# Altium schematic sheet brain.SchDoc
size A3; SheetNumber: 5; SheetTotal: 8
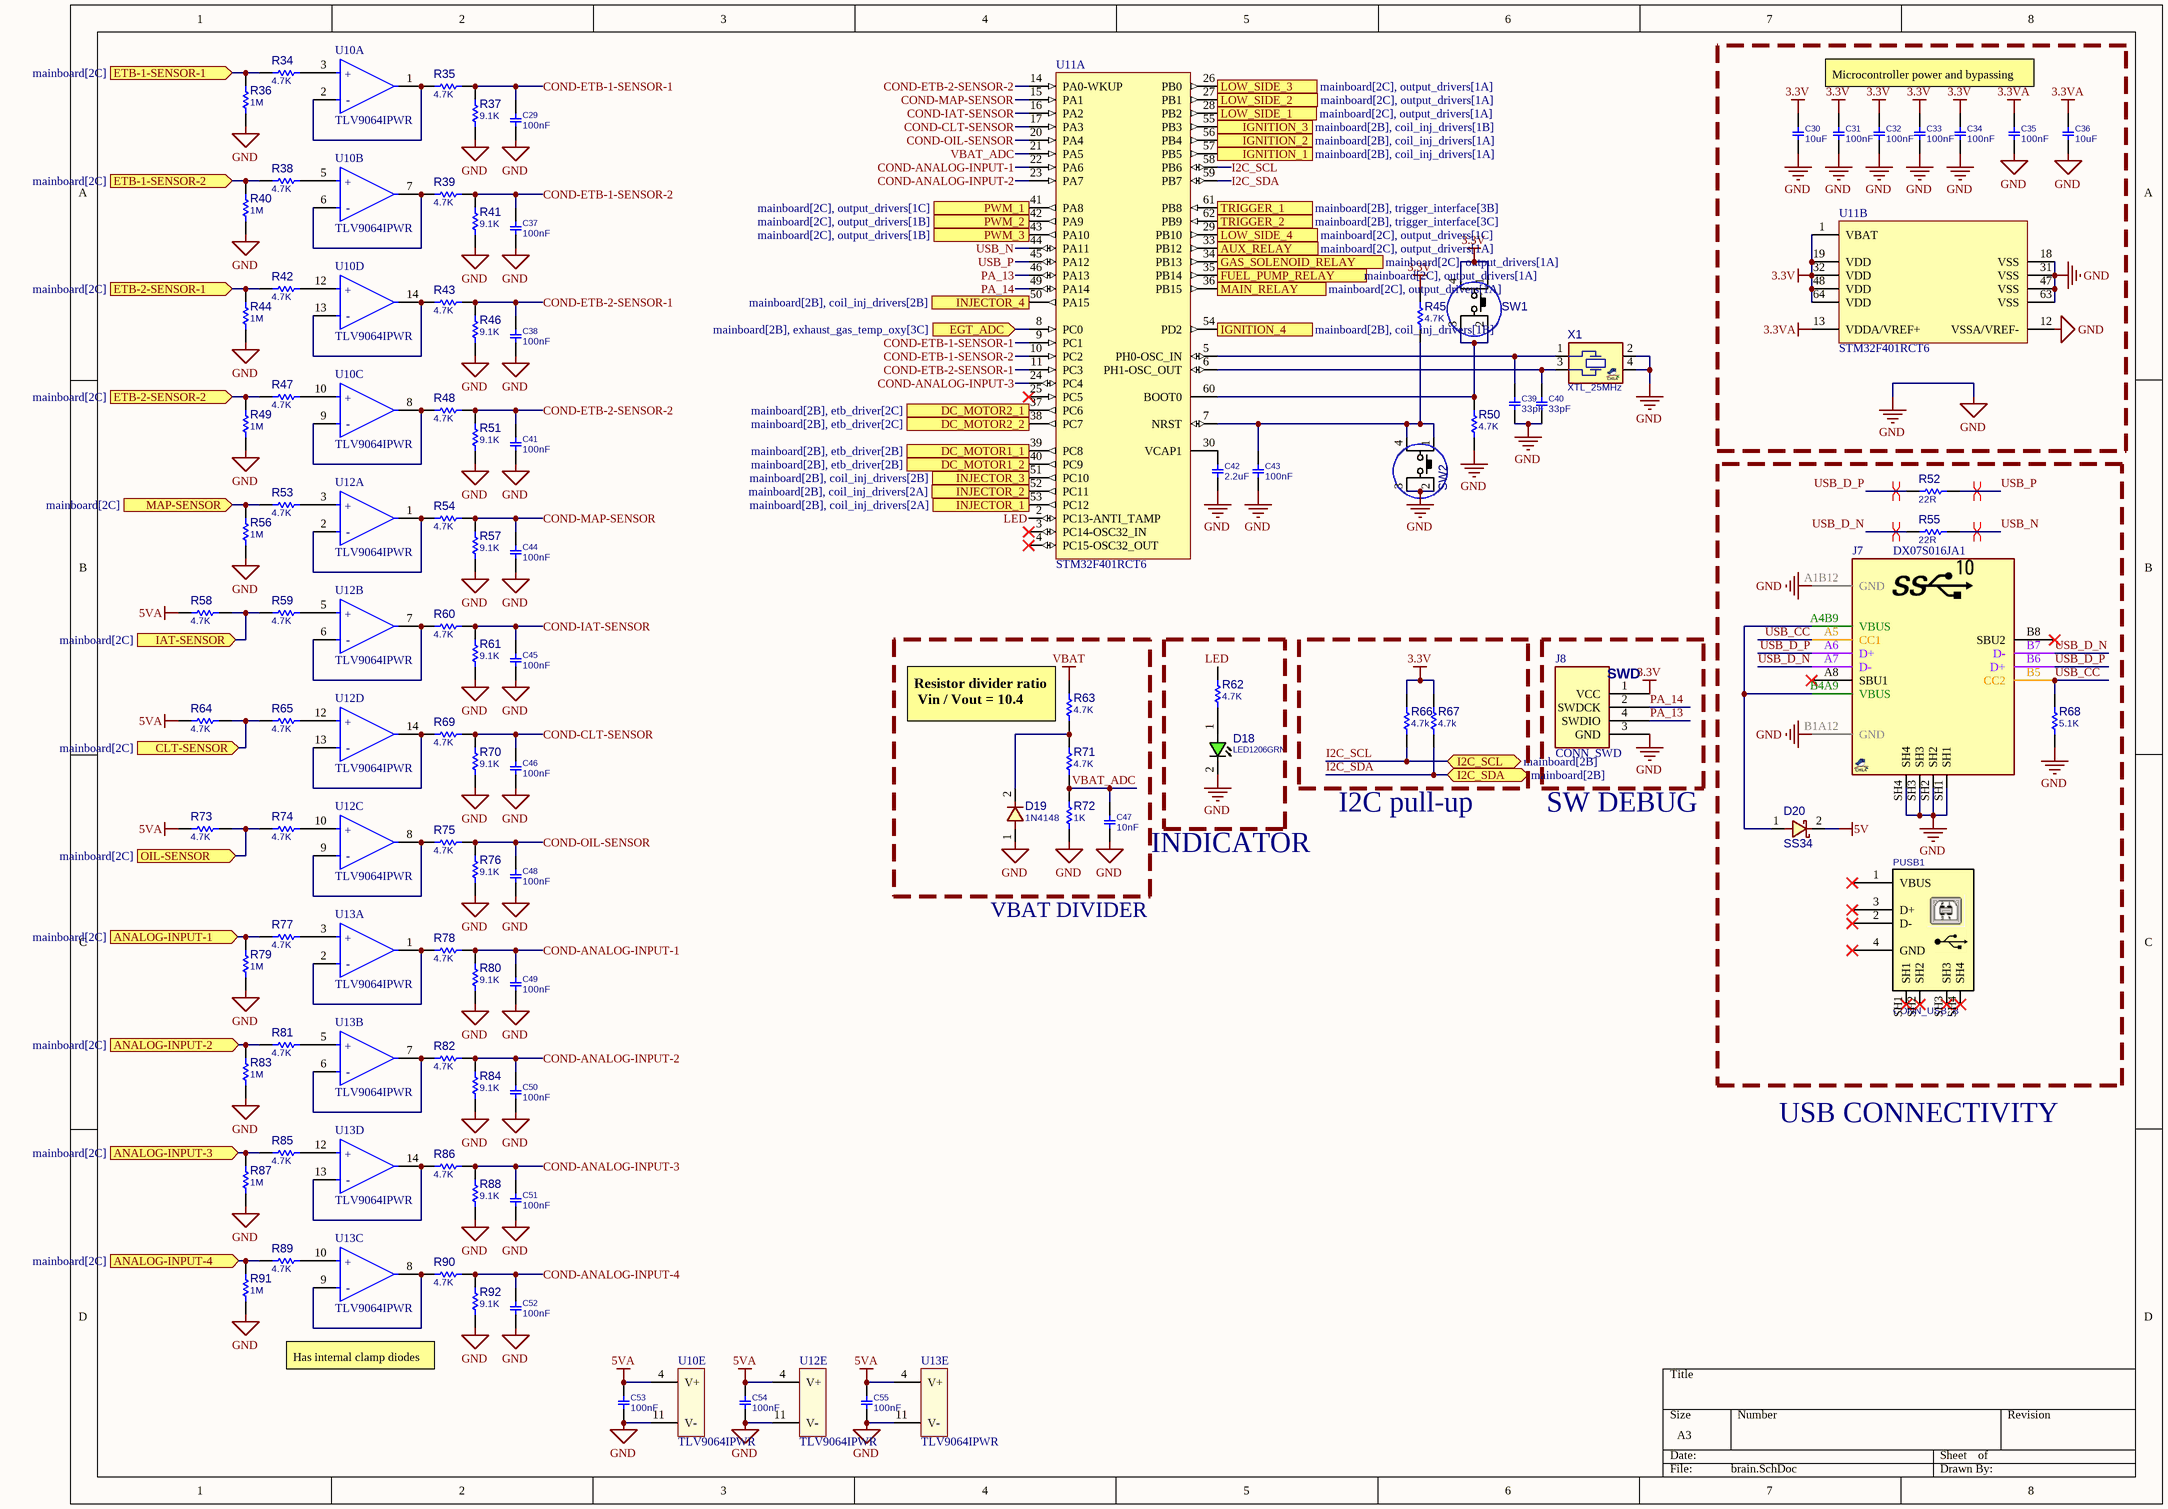
[diagram p0: brain.SchDoc]

## Parts
C29  100nF  [C0805]
C30  10uF  [C0805]
C31  100nF  [C0805]
C32  100nF  [C0805]
C33  100nF  [C0805]
C34  100nF  [C0805]
C35  100nF  [C0805]
C36  10uF  [C0805]
C37  100nF  [C0805]
C38  100nF  [C0805]
C39  33pF  [C0805]
C40  33pF  [C0805]
C41  100nF  [C0805]
C42  2.2uF  [C0805]
C43  100nF  [C0805]
C44  100nF  [C0805]
C45  100nF  [C0805]
C46  100nF  [C0805]
C47  10nF  [C0805]
C48  100nF  [C0805]
C49  100nF  [C0805]
C50  100nF  [C0805]
C51  100nF  [C0805]
C52  100nF  [C0805]
C53  100nF  [C0805]
C54  100nF  [C0805]
C55  100nF  [C0805]
D18  LED1206GRN  [LED1206GRN]
D19  1N4148  [D_SOD80]
D20  SS34  [D_SMB]
J7  DX07S016JA1  [USBC_SMD_16_DX07S016JA1]
J8  CONN_SWD  [WF_4]
PUSB1  CONN_USB_B  [USB_B_ST]
R34  4.7K  [R0805]
R35  4.7K  [R0805]
R36  1M  [R0805]
R37  9.1K  [R0805]
R38  4.7K  [R0805]
R39  4.7K  [R0805]
R40  1M  [R0805]
R41  9.1K  [R0805]
R42  4.7K  [R0805]
R43  4.7K  [R0805]
R44  1M  [R0805]
R45  4.7K  [R0805]
R46  9.1K  [R0805]
R47  4.7K  [R0805]
R48  4.7K  [R0805]
R49  1M  [R0805]
R50  4.7K  [R0805]
R51  9.1K  [R0805]
R52  22R  [R0805]
R53  4.7K  [R0805]
R54  4.7K  [R0805]
R55  22R  [R0805]
R56  1M  [R0805]
R57  9.1K  [R0805]
R58  4.7K  [R0805]
R59  4.7K  [R0805]
R60  4.7K  [R0805]
R61  9.1K  [R0805]
R62  4.7K  [R0805]
R63  4.7K  [R0805]
R64  4.7K  [R0805]
R65  4.7K  [R0805]
R66  4.7k  [R0805]
R67  4.7k  [R0805]
R68  5.1K  [R0805]
R69  4.7K  [R0805]
R70  9.1K  [R0805]
R71  4.7K  [R0805]
R72  1K  [R0805]
R73  4.7K  [R0805]
R74  4.7K  [R0805]
R75  4.7K  [R0805]
R76  9.1K  [R0805]
R77  4.7K  [R0805]
R78  4.7K  [R0805]
R79  1M  [R0805]
R80  9.1K  [R0805]
R81  4.7K  [R0805]
R82  4.7K  [R0805]
R83  1M  [R0805]
R84  9.1K  [R0805]
R85  4.7K  [R0805]
R86  4.7K  [R0805]
R87  1M  [R0805]
R88  9.1K  [R0805]
R89  4.7K  [R0805]
R90  4.7K  [R0805]
R91  1M  [R0805]
R92  9.1K  [R0805]
SW1  PUSHBUTTON  [SWPBS_SPDT_5X5X1]  (value not drawn)
SW2  PUSHBUTTON  [SWPBS_SPDT_5X5X1]  (value not drawn)
U10  TLV9064IPWR  [TTSOP-14]  (parts A,B,C,D,E of 5)
U11  STM32F401RCT6  [STM-LQFP64_L]  (parts A,B of 2)
U12  TLV9064IPWR  [TTSOP-14]  (parts A,B,C,D,E of 5)
U13  TLV9064IPWR  [TTSOP-14]  (parts A,B,C,D,E of 5)
X1  XTL_25MHz  [XTL_4_3225]

## Blocks framed on the sheet
VBAT DIVIDER: C47 D19 R63 R71 R72

## Ports
ANALOG-INPUT-1 (in, see mainboard[2C]), ANALOG-INPUT-2 (in, see mainboard[2C]), ANALOG-INPUT-3 (in, see mainboard[2C]), ANALOG-INPUT-4 (in, see mainboard[2C]), AUX_RELAY (out, see mainboard[2C], output_drivers[1A]), CLT-SENSOR (in, see mainboard[2C]), DC_MOTOR1_1 (out, see mainboard[2B], etb_driver[2B]), DC_MOTOR1_2 (out, see mainboard[2B], etb_driver[2B]), DC_MOTOR2_1 (out, see mainboard[2B], etb_driver[2C]), DC_MOTOR2_2 (out, see mainboard[2B], etb_driver[2C]), EGT_ADC (in, see mainboard[2B], exhaust_gas_temp_oxy[3C]), ETB-1-SENSOR-1 (in, see mainboard[2C]), ETB-1-SENSOR-2 (in, see mainboard[2C]), ETB-2-SENSOR-1 (in, see mainboard[2C]), ETB-2-SENSOR-2 (in, see mainboard[2C]), FUEL_PUMP_RELAY (out, see mainboard[2C], output_drivers[1A]), GAS_SOLENOID_RELAY (out, see mainboard[2C], output_drivers[1A]), I2C_SCL (bidir, see mainboard[2B]), I2C_SDA (bidir, see mainboard[2B]), IAT-SENSOR (in, see mainboard[2C]), IGNITION_1 (out, see mainboard[2B], coil_inj_drivers[1A]), IGNITION_2 (out, see mainboard[2B], coil_inj_drivers[1A]), IGNITION_3 (out, see mainboard[2B], coil_inj_drivers[1B]), IGNITION_4 (out, see mainboard[2B], coil_inj_drivers[1B]), INJECTOR_1 (out, see mainboard[2B], coil_inj_drivers[2A]), INJECTOR_2 (out, see mainboard[2B], coil_inj_drivers[2A]), INJECTOR_3 (out, see mainboard[2B], coil_inj_drivers[2B]), INJECTOR_4 (out, see mainboard[2B], coil_inj_drivers[2B]), LOW_SIDE_1 (out, see mainboard[2C], output_drivers[1A]), LOW_SIDE_2 (out, see mainboard[2C], output_drivers[1A]), LOW_SIDE_3 (out, see mainboard[2C], output_drivers[1A]), LOW_SIDE_4 (out, see mainboard[2C], output_drivers[1C]), MAIN_RELAY (out, see mainboard[2C], output_drivers[1A]), MAP-SENSOR (in, see mainboard[2C]), OIL-SENSOR (in, see mainboard[2C]), PWM_1 (out, see mainboard[2C], output_drivers[1C]), PWM_2 (out, see mainboard[2C], output_drivers[1B]), PWM_3 (out, see mainboard[2C], output_drivers[1B]), TRIGGER_1 (in, see mainboard[2B], trigger_interface[3B]), TRIGGER_2 (in, see mainboard[2B], trigger_interface[3C])

## Nets
3.3V: C30.2 C31.2 C32.2 C33.2 C34.2 J8.1(VCC) R45.2 R66.2 R67.2 SW1.1(P1) SW1.4(P2) U11.1(VBAT) U11.19(VDD) U11.32(VDD) U11.48(VDD) U11.64(VDD)
3.3VA: C35.2 C36.2 U11.13(VDDA/VREF+)
5V: D20.2
5VA: C53.2 C54.2 C55.2 R58.2 R64.2 R73.2 U10.4(V+) U12.4(V+) U13.4(V+)
GND: C29.1 C30.1 C31.1 C32.1 C33.1 C34.1 C35.1 C36.1 C37.1 C38.1 C39.1 C40.1 C41.1 C42.1 C43.1 C44.1 C45.1 C46.1 C47.1 C48.1 C49.1 C50.1 C51.1 C52.1 C53.1 C54.1 C55.1 D18.2(CATHODE) D19.1 J7.A1B12(GND) J7.B1A12(GND) J7.SH1 J7.SH2 J7.SH3 J7.SH4 J8.3(GND) R36.2 R37.2 R40.2 R41.2 R44.2 R46.2 R49.2 R50.1 R51.2 R56.2 R57.2 R61.2 R68.1 R70.2 R72.1 R76.2 R79.2 R80.2 R83.2 R84.2 R87.2 R88.2 R91.2 R92.2 SW2.2(P3) SW2.3(P4) U10.11(V-) U11.12(VSSA/VREF-) U11.18(VSS) U11.31(VSS) U11.47(VSS) U11.63(VSS) U12.11(V-) U13.11(V-) X1.2 X1.4
VBAT: R63.2
ANALOG-INPUT-1: R77.2 R79.1 ; port ANALOG-INPUT-1
ANALOG-INPUT-2: R81.2 R83.1 ; port ANALOG-INPUT-2
ANALOG-INPUT-3: R85.2 R87.1 ; port ANALOG-INPUT-3
ANALOG-INPUT-4: R89.2 R91.1 ; port ANALOG-INPUT-4
AUX_RELAY: U11.33(PB12) ; port AUX_RELAY
CLT-SENSOR: R64.1 R65.2 ; port CLT-SENSOR
COND-ANALOG-INPUT-1: C49.2 R78.1 R80.1 U11.22(PA6)
COND-ANALOG-INPUT-2: C50.2 R82.1 R84.1 U11.23(PA7)
COND-ANALOG-INPUT-3: C51.2 R86.1 R88.1 U11.24(PC4)
COND-ANALOG-INPUT-4: C52.2 R90.1 R92.1
COND-CLT-SENSOR: C46.2 R69.1 R70.1 U11.17(PA3)
COND-ETB-1-SENSOR-1: C29.2 R35.1 R37.1 U11.9(PC1)
COND-ETB-1-SENSOR-2: C37.2 R39.1 R41.1 U11.10(PC2)
COND-ETB-2-SENSOR-1: C38.2 R43.1 R46.1 U11.11(PC3)
COND-ETB-2-SENSOR-2: C41.2 R48.1 R51.1 U11.14(PA0-WKUP)
COND-IAT-SENSOR: C45.2 R60.1 R61.1 U11.16(PA2)
COND-MAP-SENSOR: C44.2 R54.1 R57.1 U11.15(PA1)
COND-OIL-SENSOR: C48.2 R75.1 R76.1 U11.20(PA4)
DC_MOTOR1_1: U11.39(PC8) ; port DC_MOTOR1_1
DC_MOTOR1_2: U11.40(PC9) ; port DC_MOTOR1_2
DC_MOTOR2_1: U11.37(PC6) ; port DC_MOTOR2_1
DC_MOTOR2_2: U11.38(PC7) ; port DC_MOTOR2_2
EGT_ADC: U11.8(PC0) ; port EGT_ADC
ETB-1-SENSOR-1: R34.2 R36.1 ; port ETB-1-SENSOR-1
ETB-1-SENSOR-2: R38.2 R40.1 ; port ETB-1-SENSOR-2
ETB-2-SENSOR-1: R42.2 R44.1 ; port ETB-2-SENSOR-1
ETB-2-SENSOR-2: R47.2 R49.1 ; port ETB-2-SENSOR-2
FUEL_PUMP_RELAY: U11.35(PB14) ; port FUEL_PUMP_RELAY
GAS_SOLENOID_RELAY: U11.34(PB13) ; port GAS_SOLENOID_RELAY
I2C_SCL: R66.1 U11.58(PB6) ; port I2C_SCL
I2C_SDA: R67.1 U11.59(PB7) ; port I2C_SDA
IAT-SENSOR: R58.1 R59.2 ; port IAT-SENSOR
IGNITION_1: U11.57(PB5) ; port IGNITION_1
IGNITION_2: U11.56(PB4) ; port IGNITION_2
IGNITION_3: U11.55(PB3) ; port IGNITION_3
IGNITION_4: U11.54(PD2) ; port IGNITION_4
INJECTOR_1: U11.53(PC12) ; port INJECTOR_1
INJECTOR_2: U11.52(PC11) ; port INJECTOR_2
INJECTOR_3: U11.51(PC10) ; port INJECTOR_3
INJECTOR_4: U11.50(PA15) ; port INJECTOR_4
LED: R62.2 U11.2(PC13-ANTI_TAMP)
LOW_SIDE_1: U11.28(PB2) ; port LOW_SIDE_1
LOW_SIDE_2: U11.27(PB1) ; port LOW_SIDE_2
LOW_SIDE_3: U11.26(PB0) ; port LOW_SIDE_3
LOW_SIDE_4: U11.29(PB10) ; port LOW_SIDE_4
MAIN_RELAY: U11.36(PB15) ; port MAIN_RELAY
MAP-SENSOR: R53.2 R56.1 ; port MAP-SENSOR
OIL-SENSOR: R73.1 R74.2 ; port OIL-SENSOR
PA_13: J8.4(SWDIO) U11.46(PA13)
PA_14: J8.2(SWDCK) U11.49(PA14)
PWM_1: U11.41(PA8) ; port PWM_1
PWM_2: U11.42(PA9) ; port PWM_2
PWM_3: U11.43(PA10) ; port PWM_3
TRIGGER_1: U11.61(PB8) ; port TRIGGER_1
TRIGGER_2: U11.62(PB9) ; port TRIGGER_2
USB_CC: J7.A5(CC1) J7.B5(CC2) R68.2
USB_D_N: J7.A7(D-) J7.B7(D-) R55.2
USB_D_P: J7.A6(D+) J7.B6(D+) R52.2
USB_N: R55.1 U11.44(PA11)
USB_P: R52.1 U11.45(PA12)
VBAT_ADC: C47.2 R71.1 R72.2 U11.21(PA5)
NetC39_2: C39.2 U11.5(PH0-OSC_IN) X1.1
NetC40_2: C40.2 U11.6(PH1-OSC_OUT) X1.3
NetC42_2: C42.2 U11.30(VCAP1)
NetC43_2: C43.2 R45.1 SW2.1(P1) SW2.4(P2) U11.7(NRST)
NetD18_1: D18.1(ANODE) R62.1
NetD19_2: D19.2 R63.1 R71.2
NetD20_1: D20.1 J7.A4B9(VBUS) J7.B4A9(VBUS)
NetR34_1: R34.1 U10.3(IN1+)
NetR35_2: R35.2 U10.1(OUT1) U10.2(IN1-)
NetR38_1: R38.1 U10.5(IN2+)
NetR39_2: R39.2 U10.6(IN2-) U10.7(OUT2)
NetR42_1: R42.1 U10.12(IN4+)
NetR43_2: R43.2 U10.13(IN4-) U10.14(OUT4)
NetR47_1: R47.1 U10.10(IN3+)
NetR48_2: R48.2 U10.8(OUT3) U10.9(IN3-)
NetR50_2: R50.2 SW1.2(P3) SW1.3(P4) U11.60(BOOT0)
NetR53_1: R53.1 U12.3(IN1+)
NetR54_2: R54.2 U12.1(OUT1) U12.2(IN1-)
NetR59_1: R59.1 U12.5(IN2+)
NetR60_2: R60.2 U12.6(IN2-) U12.7(OUT2)
NetR65_1: R65.1 U12.12(IN4+)
NetR69_2: R69.2 U12.13(IN4-) U12.14(OUT4)
NetR74_1: R74.1 U12.10(IN3+)
NetR75_2: R75.2 U12.8(OUT3) U12.9(IN3-)
NetR77_1: R77.1 U13.3(IN1+)
NetR78_2: R78.2 U13.1(OUT1) U13.2(IN1-)
NetR81_1: R81.1 U13.5(IN2+)
NetR82_2: R82.2 U13.6(IN2-) U13.7(OUT2)
NetR85_1: R85.1 U13.12(IN4+)
NetR86_2: R86.2 U13.13(IN4-) U13.14(OUT4)
NetR89_1: R89.1 U13.10(IN3+)
NetR90_2: R90.2 U13.8(OUT3) U13.9(IN3-)

Not connected (* = marked no-connect by the designer): J7 A8(SBU1)* B8(SBU2)*; PUSB1 1(VBUS)* 2(D-)* 3(D+)* 4(GND)* SH1* SH2* SH3* SH4*; U11 3(PC14-OSC32_IN)* 4(PC15-OSC32_OUT)* 25(PC5)*

## Layout directives
differential pair: USB_D_N, USB_D_P, USB_N, USB_P

## Notes on the sheet
- Microcontroller power and bypassing
- (near R63) Resistor divider ratio
  Vin / Vout = 10.4
- INDICATOR
- I2C pull-up
- (near J8) SW DEBUG
- USB CONNECTIVITY
- Has internal clamp diodes
- (in symbol CONN_SWD) SWD
- (in symbol TLV9064, part A) +; -
- (in symbol TLV9064, part B) +; -
- (in symbol TLV9064, part C) +; -
- (in symbol TLV9064, part D) +; -

## Library data of the parts
C29-C55 = CAP_SMD_MLCC: CAP, MLCC; PARAM: C0G, 10%; DESC: CAP, MLCC, 1nF, 50V, C0G, 10%, 0402; MANF_P#: MANF_PART#; MANF: Murata; PARAM2: 50V; PRICE: 100= 1$; ASSEMBLY: ASSEMBLY
  C29 C31-C35 C37 C38 C41 C43-C46 C48-C55: VALUE: 100nF
  C30 C36: VALUE: 10uF
  C39 C40: VALUE: 33pF
  C42: VALUE: 2.2uF
  C47: VALUE: 10nF
D18 = LED_SMD_1206_GRN: LED, SMD, 1206, GREEN; PARAM: 20mA; DESC: DESCRIPTION; PARAM2: 2.2V; MANF: -; ASSEMBLY: ASSEMBLY; PRICE: 36t@Javan; MANF_P#: -; VALUE: LED1206GRN
D19 = DIODE_SMD_1N4148_SOD80: DIODE, FAST SWTICHING, 0.3A, 0.5W; DESC: DESCRIPTION; PARAM: 75V; PARAM2: 300mA, 0.5W; MANF: MANF; ASSEMBLY: ASSEMBLY; PRICE: PRICE; MANF_P#: 1N4148; VALUE: 1N4148
D20 = DIODE_SMD_SCHOTTKY_SS34: DIODE, SCHOTTKY, 20V, 3A; MANF: VISHAY; DESC: DESCRIPTION; MANF_P#: SS34; ASSEMBLY: ASSEMBLY; PRICE: PRICE; PARAM2: 3A; PARAM: 20V; VALUE: SS34
J7 = CONN_USBC_SMD_16_DX07S016JA1: CONN, USB, Type C, USB 2.0, Right-Angle, SMD; MANF: JAE; MANF_P#: DX07S016JA1R1500; PARAM: 5A; Price: 1.5$; Value: DX07S016JA1
J8 = CONN_SWD: CONN, SWD, ST; VALUE: CONN_SWD
PUSB1 = CONN_USB_B_ST: CONN, USB, B, STRAIGHT, THD; MANF_P#: -; MANF: -; VALUE: CONN_USB_B
R34-R51 R53 R54 R56-R67 R69-R92 = RES_SMD: RESISTOR, SMD; PARAM: -W; DESC: DESCRIPTION; DIST#: MOUSER; PARAM2: 1%; MANF_P#: -; MANF: -; ASSEMBLY: ASSEMBLY; PRICE: 100= 0.5$
  R34 R35 R38 R39 R42 R43 R45 R47 R48 R50 R53 R54 R58-R60 R62-R65 R69 R71 R73-R75 R77 R78 R81 R82 R85 R86 R89 R90: VALUE: 4.7K
  R36 R40 R44 R49 R56 R79 R83 R87 R91: VALUE: 1M
  R37 R41 R46 R51 R57 R61 R70 R76 R80 R84 R88 R92: VALUE: 9.1K
  R66 R67: VALUE: 4.7k
  R72: VALUE: 1K
R52 R55 R68 = RES_SMD_0805: RESISTOR, SMD; PARAM: -W; DESC: DESCRIPTION; DIST#: MOUSER; PARAM2: 1%; MANF_P#: -; MANF: -; ASSEMBLY: ASSEMBLY; PRICE: 100= 0.5$
  R52 R55: VALUE: 22R
  R68: VALUE: 5.1K
SW1 SW2 = SWPBS_SPDT_5X5PTS: SWITCH, PUSH BUTTON, TACTILE, SMD, SPDT, 5X5MM; MANF: CHINA; PARAM: 50mA; DESC: DESCRIPTION; MANF_P#: PTS526SM15SMTR2LFS; PARAM2: 500kCycle; VALUE: PUSHBUTTON; ASSEMBLY: ASSEMBLY; PRICE: -
U10 U12 U13 = TLV9064: IC CMOS 4 CIRCUIT 14TSSOP; Output Current per Channel: 50mA; Gain Bandwidth Product: 10MHz; Operating Supply Current: 538uA; Input Bias Current: 0.5pA; Input Offset Voltage (Vos): 300uV; Number of Channels: 4; Slew Rate: 6.5V/µs; Mount: Surface Mount; Min Operating Temperature: -40°C; Case/Package: TSSOP; RoHS Compliant: Yes; Packaging: Tape and Reel; Number of Pins: 14; Number of Circuits: 4; Max Operating Temperature: 125°C
U11 = STM32F401RCT6: ARM Cortex-M4 32-bit MCU+FPU, 105 DMIPS, 256 kB Flash, 64 kB Internal RAM, 48 I/Os, 64-pin LQFP, -40 to 85 degC, Tray; Manufacturer: STMicroelectronics; Internal RAM Size (kB): 64; Supply Voltage(Vcc) max (V): 3.6; FLASH Size (Prog) (kB): 256; I/Os (High Current): 48; Operating Frequency(F) (Processor speed) (MHz): 84; Supply Voltage(Vcc) min (V): 1.8; DatasheetVersion: Rev. 1; ComponentLink1URL: http://www.st.com/web/en/home.html; ComponentLink1Description: Manufacturer URL; PackageDescription: 64-Pin Low Profile Quad Flat Package, 10 x 10 mm Body, 0.5 mm Pitch; Packing: Tray; ComponentLink3URL: http://www.st.com/st-web-ui/static/active/en/resource/technical/document/datasheet/DM00037051.pdf; PackageVersion: Rev. 4, 06/2013; ComponentLink2URL: http://www.st.com/st-web-ui/static/active/en/resource/technical/document/data_brief/DM00071938.pdf; PartNumber: STM32F401RCT6; PackageReference: LQFP64; Mounting Technology: Surface Mount; ComponentLink2Description: Datasheet; ComponentLink3Description: Package Specification; Core: ARM Cortex-M4
X1 = XTL_4_25MHZ_3225A_2: CRYSTAL 25.00 MHZ 4pF, 10PPM; MANF: ABRACON; PARAM: 10PPM, 4pF, -40~85oC; DESC: DESCRIPTION; DIST#: MOUSER; MANF_P#: ABM8W-25.0000MHZ-4-D1X-T3; PARAM2: 0.6$; ASSEMBLY: ASSEMBLY; PRICE: PRICE; VALUE: XTL_25MHz